# EAGLE schematic BSPD_rev11_v3 (EAGLE 9.6.2)
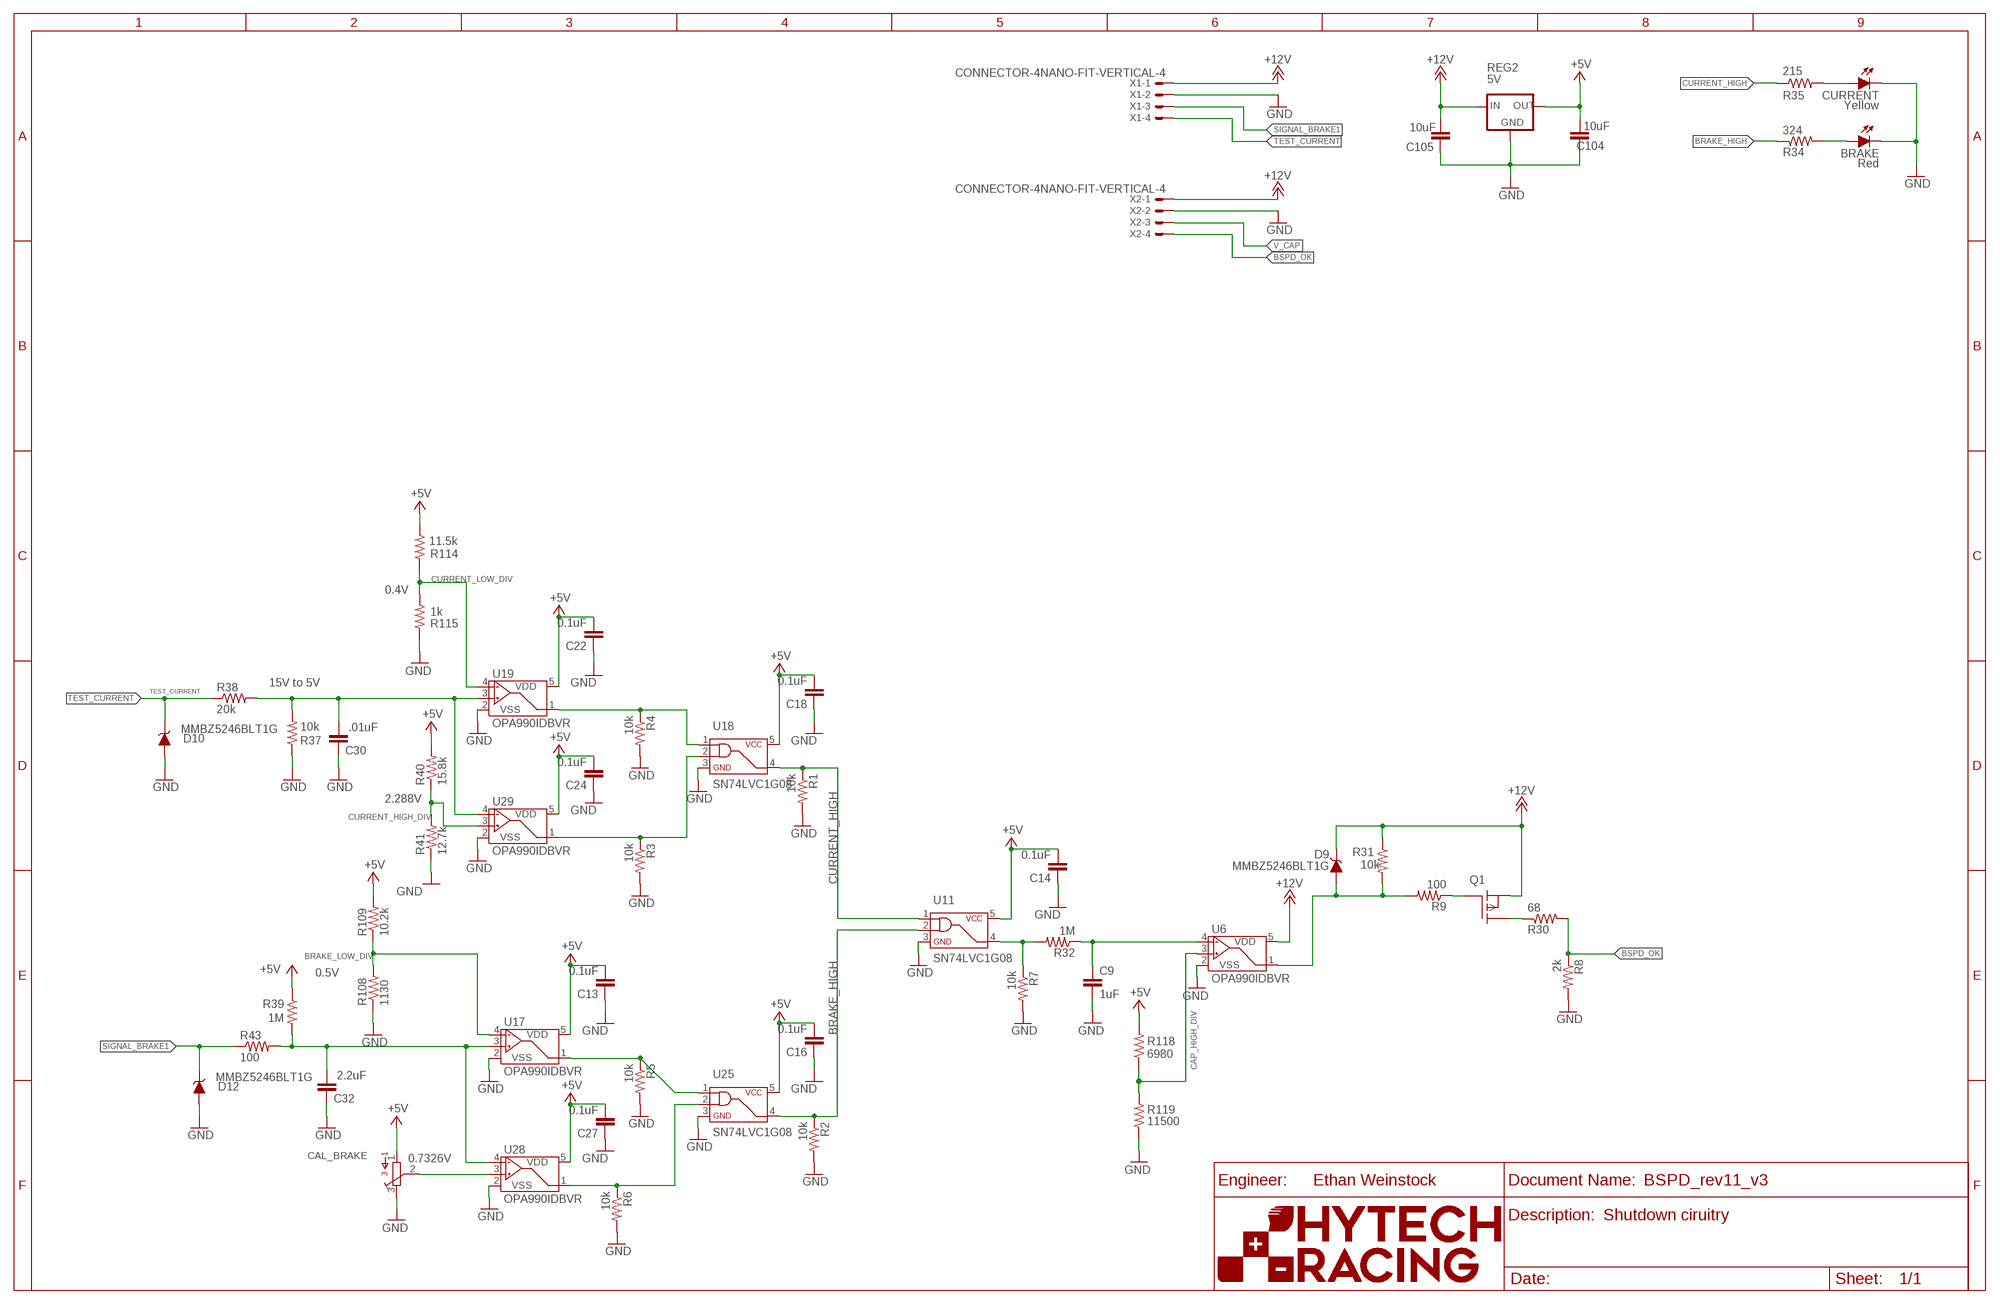
[diagram p0: schematic, sheet 1]
U202 (FRAME_B_L): ORIENTATION: LANDSCAPE; SIZE: B

## Parts
BRAKE  Red  LED-0805  [LED-805]
C9  1uF  CAP0603-CAP  [0603-CAP]
C13  0.1uF  CAP0603-CAP  [0603-CAP]
C14  0.1uF  CAP0603-CAP  [0603-CAP]
C16  0.1uF  CAP0603-CAP  [0603-CAP]
C18  0.1uF  CAP0603-CAP  [0603-CAP]
C22  0.1uF  CAP0603-CAP  [0603-CAP]
C24  0.1uF  CAP0603-CAP  [0603-CAP]
C27  0.1uF  CAP0603-CAP  [0603-CAP]
C30  .01uF  CAP0603-CAP  [0603-CAP]
C32  2.2uF  CAP0603-CAP  [0603-CAP]
C104  10uF  CAP0603-CAP  [0603-CAP]
C105  10uF  CAP0603-CAP  [0603-CAP]
CAL_BRAKE  TRIMPOT_3296C  [TRIMPOT_3296]
CURRENT  Yellow  LED-0805  [LED-805]
D9  MMBZ5246BLT1G  DIODE_ZENER  [SOT23]
D10  MMBZ5246BLT1G  DIODE_ZENER  [SOT23]
D12  MMBZ5246BLT1G  DIODE_ZENER  [SOT23]
Q1  P-CHANNEL_MOSFET_DMP3099L-7  [SOT23]
R1  10k  RESISTOR0603  [0603-RES]
R2  10k  RESISTOR0603  [0603-RES]
R3  10k  RESISTOR0603  [0603-RES]
R4  10k  RESISTOR0603  [0603-RES]
R5  10k  RESISTOR0603  [0603-RES]
R6  10k  RESISTOR0603  [0603-RES]
R7  10k  RESISTOR0603  [0603-RES]
R8  2k  RESISTOR0603  [0603-RES]
R9  100  RESISTOR0603  [0603-RES]
R30  68  RESISTOR0603  [0603-RES]
R31  10k  RESISTOR0603  [0603-RES]
R32  1M  RESISTOR0603  [0603-RES]
R34  324  RESISTOR0603  [0603-RES]
R35  215  RESISTOR0603  [0603-RES]
R37  10k  RESISTOR0603  [0603-RES]
R38  20k  RESISTOR0603  [0603-RES]
R39  1M  RESISTOR0603  [0603-RES]
R40  15.8k  RESISTOR0603  [0603-RES]
R41  12.7k  RESISTOR0603  [0603-RES]
R43  100  RESISTOR0603  [0603-RES]
R108  1130  RESISTOR0603  [0603-RES]
R109  10.2k  RESISTOR0603  [0603-RES]
R114  11.5k  RESISTOR0603  [0603-RES]
R115  1k  RESISTOR0603  [0603-RES]
R118  6980  RESISTOR0603  [0603-RES]
R119  11500  RESISTOR0603  [0603-RES]
REG2  5V  OKI-78SR-5  [OKI-78SR]
U6  OPA990IDBVR  [SOT-23-5]
U11  SN74LVC1G08  [SOT-23-5]
U17  OPA990IDBVR  [SOT-23-5]
U18  SN74LVC1G08  [SOT-23-5]
U19  OPA990IDBVR  [SOT-23-5]
U25  SN74LVC1G08  [SOT-23-5]
U28  OPA990IDBVR  [SOT-23-5]
U29  OPA990IDBVR  [SOT-23-5]
X1  CONNECTOR-4NANO-FIT-VERTICAL-4  [NANO-FIT_VERTICAL-4]
X2  CONNECTOR-4NANO-FIT-VERTICAL-4  [NANO-FIT_VERTICAL-4]

## Nets
+5V: C13.2 C14.2 C16.2 C18.2 C22.2 C24.2 C27.2 C104.2 CAL_BRAKE.1 R39.1 R40.2 R109.2 R114.2 R118.2 REG2.3(OUT) U11.5 U17.5(VDD) U18.5 U19.5(VDD) U25.5 U28.5(VDD) U29.5(VDD)
+12V: C105.2 D9.3(C) Q1.2(S) R31.1 REG2.1(IN) U6.5(VDD) X1.P$1 X2.P$1
BRAKE_HIGH: R2.1 R34.1 U11.2 U25.4
BRAKE_LOW_DIV: R108.2 R109.1 U17.4(VIN-)
BSPD_OK: R8.1 R30.2 X2.P$4
CAP_HIGH_DIV: R118.1 R119.2 U6.3(VIN+)
CURRENT_HIGH: R1.1 R35.1 U11.1 U18.4
CURRENT_HIGH_DIV: R40.1 R41.2 U29.3(VIN+)
CURRENT_LOW_DIV: R114.1 R115.2 U19.4(VIN-)
GND: BRAKE.C C9.2 C13.1 C14.1 C16.1 C18.1 C22.1 C24.1 C27.1 C30.1 C32.1 C104.1 C105.1 CAL_BRAKE.3 CURRENT.C D10.1(A) D12.1(A) R1.2 R2.2 R3.2 R4.2 R5.2 R6.2 R7.2 R8.2 R37.1 R41.1 R108.1 R115.1 R119.1 REG2.2(GND) U6.2(VSS) U11.3 U17.2(VSS) U18.3 U19.2(VSS) U25.3 U28.2(VSS) U29.2(VSS) X1.P$2 X2.P$2
N$1: Q1.3(D) R30.1
N$2: Q1.1(G) R9.1
N$3: CAL_BRAKE.2 U28.3(VIN+)
N$5: C32.2 R39.2 R43.2 U17.3(VIN+) U28.4(VIN-)
N$6: R5.1 U17.1(VOUT) U25.1
N$8: R6.1 U25.2 U28.1(VOUT)
N$18: R4.1 U18.1 U19.1(VOUT)
N$19: R3.1 U18.2 U29.1(VOUT)
N$102: CURRENT.A R35.2
N$103: BRAKE.A R34.2
N$106: C30.2 R37.2 R38.2 U19.3(VIN+) U29.4(VIN-)
N$107: R7.1 R32.2 U11.4
N$109: C9.1 R32.1 U6.4(VIN-)
N$112: D9.1(A) R9.2 R31.2 U6.1(VOUT)
SIGNAL_BRAKE1: D12.3(C) R43.1 X1.P$3
TEST_CURRENT: D10.3(C) R38.1 X1.P$4
V_CAP: X2.P$3

## Notes on the sheet
- 0.4V
- 15V to 5V
- 2.288V
- 0.5V
- 0.7326V
- Ethan Weinstock
- Shutdown ciruitry

## Library data of the parts
BRAKE CURRENT = HyTechDevices:LED: Light Emitting Diode (LED) Source: Dangerous Prototypes Eagle Library <https://github.com/DangerousPrototypes/Eagle_Part_Library>
C9 C13 C14 C16 C18 C22 C24 C27 C30 C32 C104 C105 = HyTechDevices:CAP: Capacitor Standard 0603 ceramic capacitor, and 0.1" leaded capacitor.
CAL_BRAKE = HyTechDevices:TRIMPOT_3296: 3296 Series 3/8" Square Trimmer Source <https://github.com/chiengineer/Eagle-Libraries/blob/master/Potentiometers/bourns.lbr>
D9 D10 D12 = HyTechDevices:DIODE_ZENER: ZENER DIODE
Q1 = HyTechDevices:P-CHANNEL_MOSFET_DMP3099L-7: Diodes Incorporated P-Channel Enhancement Mode MOSFET Datasheet <http://www.mouser.com/ds/2/115/DMP3099L-266220.pdf>
R1-R9 R30-R32 R34 R35 R37-R41 R43 R108 R109 R114 R115 R118 R119 = HyTechDevices:RESISTOR: Resistor Basic schematic elements and footprints for 0603, 1206, and PTH resistors.
REG2 = HyTechDevices:OKI-78SR-5: Murata OKI-78SR 5V 1.5A Non-Isolated Switching Regulator DC/DC - Datasheet <https://power.murata.com/data/power/oki-78sr.pdf>
U6 U17 U19 U28 U29 = HyTechDevices:OPA990IDBVR: TI OPA990 20V Op-Amp Comparator Datasheet <https://www.ti.com/lit/ds/symlink/opa990.pdf>
U11 U18 U25 = HyTechDevices:SN74LVC1G08: TI SN74LVC1G08 SINGLE 2-INPUT POSITIVE-AND GATE Datasheet <https://www.ti.com/lit/ds/symlink/sn74lvc1g08.pdf>
X1 X2 = HyTechDevices:CONNECTOR-4: Mini-Fit Junior connector 4 pole Source: http://www.molex.com